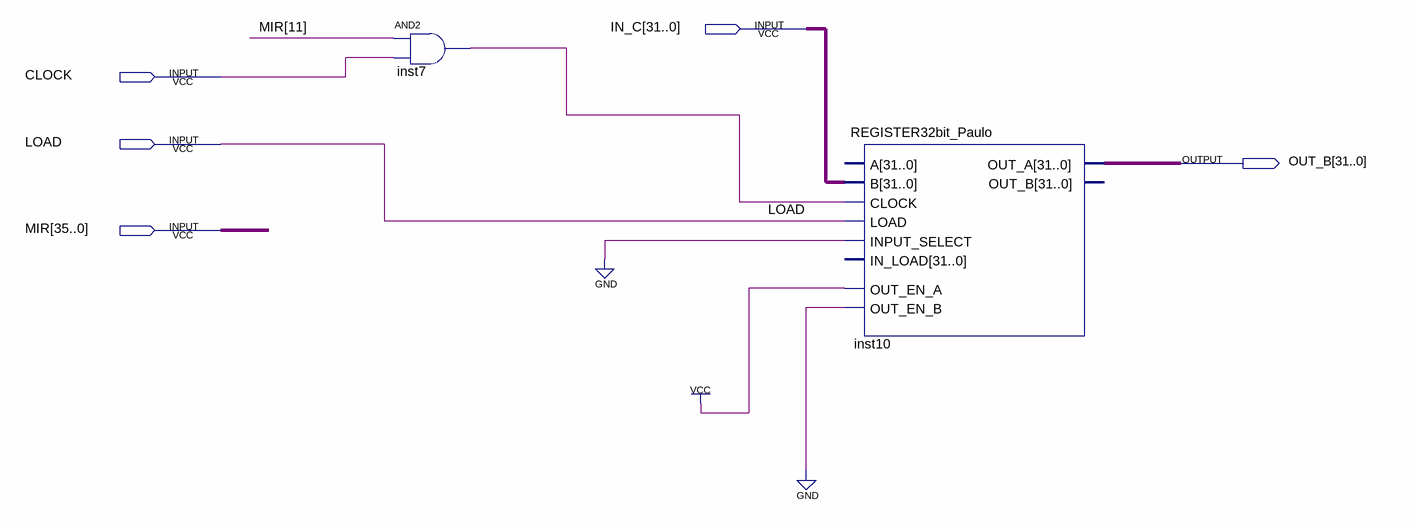
[diagram p0: schematic sheet]
// Quartus schematic H.bdf as structural Verilog: 2 symbols, 5 pins
module H (
  input  [31:0] IN_C,
  input  CLOCK,
  input  LOAD,
  input  [35:0] MIR,
  output [31:0] OUT_B
);

  wire inst7_out;

  and inst7 (inst7_out, MIR[11], CLOCK);
  REGISTER32bit_Paulo inst10 (
    .B(IN_C), .OUT_EN_A(1'b1), .INPUT_SELECT(1'b0), .LOAD(LOAD), .OUT_EN_B(1'b0), .CLOCK(inst7_out),
    .OUT_A(OUT_B));  // open: A, IN_LOAD, OUT_B
endmodule
